# EAGLE design bitbox_rev2c-1 (EAGLE 7.6.0)
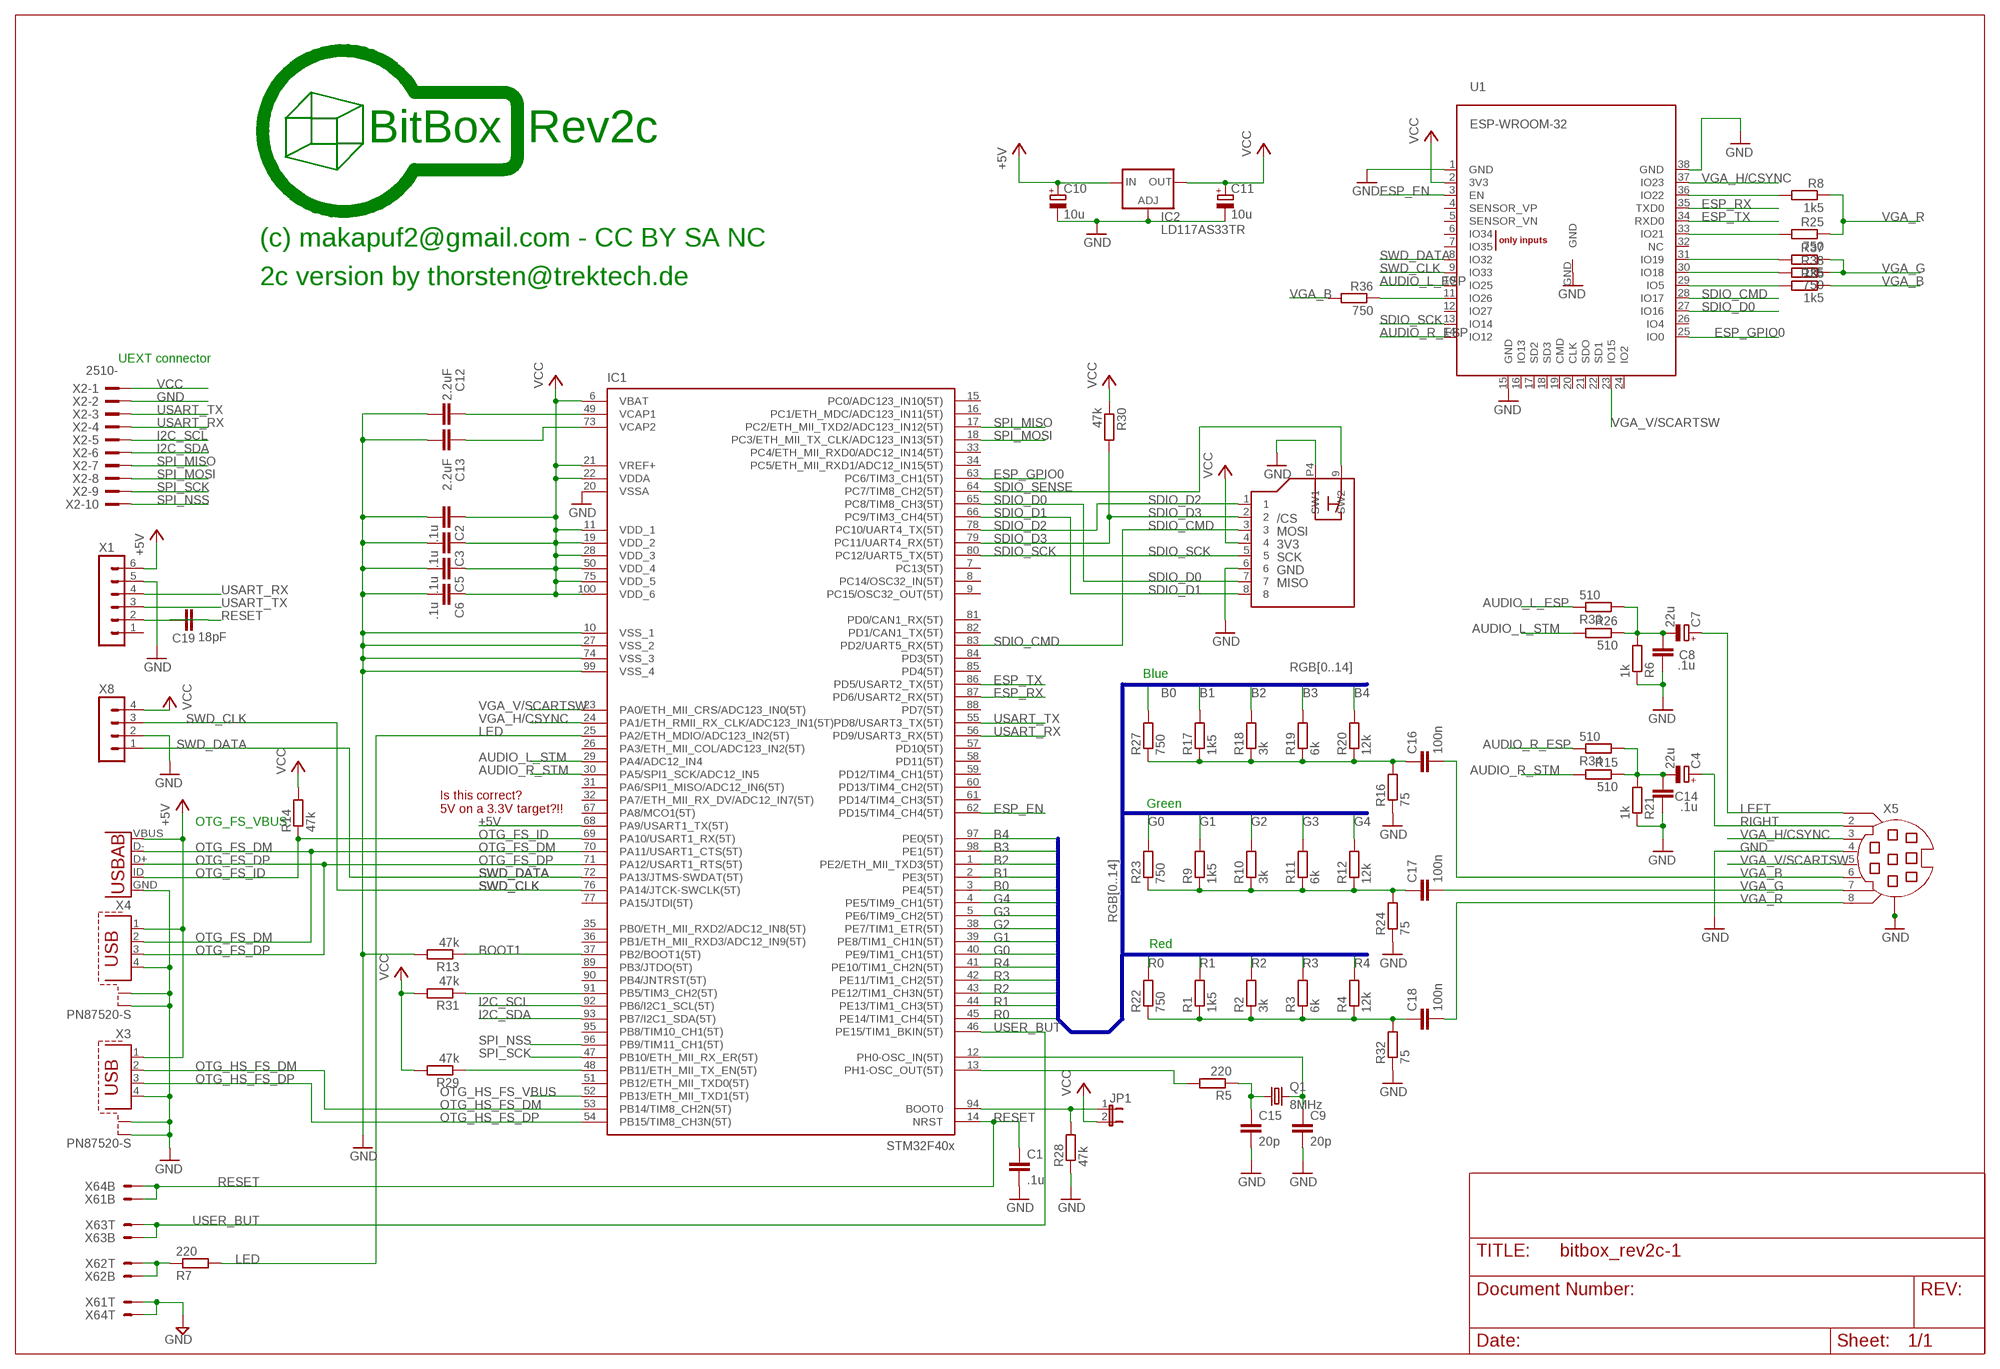
[diagram p0: schematic, sheet 1]

## Parts
C1  .1u  C-EUC0805  [C0805]
C2  .1u  C-EUC0805  [C0805]
C3  .1u  C-EUC0805  [C0805]
C4  22u  CPOL-EU153CLV-0505  [153CLV-0505]
C5  .1u  C-EUC0805  [C0805]
C6  .1u  C-EUC0805  [C0805]
C7  22u  CPOL-EU153CLV-0505  [153CLV-0505]
C8  .1u  C-EUC0805  [C0805]
C9  20p  C-EUC0805  [C0805]
C10  10u  CPOL-EUSMCA  [SMC_A]
C11  10u  CPOL-EUSMCA  [SMC_A]
C12  2.2uF  C-EUC0805  [C0805]
C13  2.2uF  C-EUC0805  [C0805]
C14  .1u  C-EUC0805  [C0805]
C15  20p  C-EUC0805  [C0805]
C16  100n  C-EUC0805  [C0805]
C17  100n  C-EUC0805  [C0805]
C18  100n  C-EUC0805  [C0805]
C19  18pF  C-EUC0805  [C0805]
IC1  STM32F407V  [TQFP100]
IC2  LD117AS33TR  [SOT223]
J1  MICROSD-SWITCH  [MICROSD-ATOM]
JP1  JP1E  [JP1]
Q1  8MHz  CRYSTALSM49  [SM49]
R1  1k5  R-EU_R0805  [R0805]
R2  3k  R-EU_R0805  [R0805]
R3  6k  R-EU_R0805  [R0805]
R4  12k  R-EU_R0805  [R0805]
R5  220  R-EU_R0805  [R0805]
R6  1k  R-EU_R0805  [R0805]
R7  220  R-EU_R0805  [R0805]
R8  1k5  R-EU_R0805  [R0805]
R9  1k5  R-EU_R0805  [R0805]
R10  3k  R-EU_R0805  [R0805]
R11  6k  R-EU_R0805  [R0805]
R12  12k  R-EU_R0805  [R0805]
R13  47k  R-EU_R0805  [R0805]
R14  47k  R-EU_R0805  [R0805]
R15  510  R-EU_R0805  [R0805]
R16  75  R-EU_R0805  [R0805]
R17  1k5  R-EU_R0805  [R0805]
R18  3k  R-EU_R0805  [R0805]
R19  6k  R-EU_R0805  [R0805]
R20  12k  R-EU_R0805  [R0805]
R21  1k  R-EU_R0805  [R0805]
R22  750  R-EU_R0805  [R0805]
R23  750  R-EU_R0805  [R0805]
R24  75  R-EU_R0805  [R0805]
R25  750  R-EU_R0805  [R0805]
R26  510  R-EU_R0805  [R0805]
R27  750  R-EU_R0805  [R0805]
R28  47k  R-EU_R0805  [R0805]
R29  47k  R-EU_R0805  [R0805]
R30  47k  R-EU_R0805  [R0805]
R31  47k  R-EU_R0805  [R0805]
R32  75  R-EU_R0805  [R0805]
R33  510  R-EU_R0805  [R0805]
R34  510  R-EU_R0805  [R0805]
R35  1k5  R-EU_R0805  [R0805]
R36  750  R-EU_R0805  [R0805]
R37  1k5  R-EU_R0805  [R0805]
R38  750  R-EU_R0805  [R0805]
U1  ESP-WROOM-32  [ESP-WROOM-32]
X1  MA06-1  [MA06-1]
X2  2510-  [PAK100/2500-10]
X3  PN87520-S  [PN87520-S]
X4  PN87520-S  [PN87520-S]
X5  MINI-DIN-8  [MINI-DIN-8]
X6  PCB_CONNECTOR_4X2  [PCB_CONNECTOR_2X4POL]
X7  USB-AB  [USB-AB-MICRO-SMD]
X8  MA04-1  [MA04-1]

## Nets
+5V: C10.+ IC1.68(PA9/USART1_TX(5T)) IC2.3(IN) X1.6 X3.1 X4.1 X7.VBUS
AUDIO_L: C7.- C8.1 R6.2 R26.1 R33.2
AUDIO_L_ESP: R33.1 U1.10(IO25)
AUDIO_L_STM: IC1.29(PA4/ADC12_IN4) R26.2
AUDIO_R: C4.- C14.1 R15.1 R21.2 R34.2
AUDIO_R_ESP: R34.1 U1.14(IO12)
AUDIO_R_STM: IC1.30(PA5/SPI1_SCK/ADC12_IN5) R15.2
B0: IC1.3(PE4(5T)) R27.2
B1: IC1.2(PE3(5T)) R17.2
B2: IC1.1(PE2/ETH_MII_TXD3(5T)) R18.2
B3: IC1.98(PE1(5T)) R19.2
B4: IC1.97(PE0(5T)) R20.2
BOOT1: IC1.37(PB2/BOOT1(5T)) R13.1
ESP_EN: IC1.62(PD15/TIM4_CH4(5T)) U1.3(EN)
ESP_GPIO0: IC1.63(PC6/TIM3_CH1(5T)) U1.25(IO0)
ESP_RX: IC1.87(PD6/USART2_RX(5T)) U1.35(TXD0)
ESP_TX: IC1.86(PD5/USART2_TX(5T)) U1.34(RXD0)
G0: IC1.40(PE9/TIM1_CH1(5T)) R23.2
G1: IC1.39(PE8/TIM1_CH1N(5T)) R9.2
G2: IC1.38(PE7/TIM1_ETR(5T)) R10.2
G3: IC1.5(PE6/TIM9_CH2(5T)) R11.2
G4: IC1.4(PE5/TIM9_CH1(5T)) R12.2
GND: C1.2 C2.2 C3.2 C5.2 C6.2 C8.2 C9.2 C10.- C11.- C12.2 C13.2 C14.2 C15.2 IC1.10(VSS_1) IC1.20(VSSA) IC1.27(VSS_2) IC1.74(VSS_3) IC1.99(VSS_4) IC2.1(ADJ) J1.6 J1.P4(SW1) R6.1 R13.2 R16.1 R21.1 R24.1 R28.1 R32.1 U1.1(GND) U1.15(GND) U1.38(GND) U1.GND X1.5 X2.2 X3.4 X3.S1 X3.S2 X4.4 X4.S1 X4.S2 X5.4 X5.G(G1) X6.1T X6.4T X7.GND X8.2
I2C_SCL: IC1.92(PB6/I2C1_SCL(5T)) X2.5
I2C_SDA: IC1.93(PB7/I2C1_SDA(5T)) X2.6
LED: IC1.25(PA2/ETH_MDIO/ADC123_IN2(5T)) R7.2
LEFT: C7.+ X5.1
N$1: C19.2 X1.2
N$2: C13.1 IC1.73(VCAP2)
N$3: C16.1 R16.2 R17.1 R18.1 R19.1 R20.1 R27.1
N$4: C12.1 IC1.49(VCAP1)
N$5: R8.2 U1.36(IO22)
N$6: C15.1 Q1.1 R5.1
N$7: C9.1 IC1.12(PH0-OSC_IN(5T)) Q1.2
N$10: C17.1 R9.1 R10.1 R11.1 R12.1 R23.1 R24.2
N$12: R25.2 U1.33(IO21)
N$15: IC1.91(PB5/TIM3_CH2(5T)) R31.1
N$16: R37.2 U1.31(IO19)
N$17: IC1.13(PH1-OSC_OUT(5T)) R5.2
N$18: IC1.94(BOOT0) JP1.1 R28.2
N$22: R38.2 U1.30(IO18)
N$23: R35.2 U1.29(IO5)
N$24: R7.1 X6.2B X6.2T
N$25: C18.1 R1.1 R2.1 R3.1 R4.1 R22.1 R32.2
N$26: R36.1 U1.11(IO26)
OTG_FS_DM: IC1.70(PA11/USART1_CTS(5T)) X4.2 X7.D-
OTG_FS_DP: IC1.71(PA12/USART1_RTS(5T)) X4.3 X7.D+
OTG_FS_ID: IC1.69(PA10/USART1_RX(5T)) R14.1 X7.ID(USBID)
OTG_HS_FS_DM: IC1.53(PB14/TIM8_CH2N(5T)) X3.2
OTG_HS_FS_DP: IC1.54(PB15/TIM8_CH3N(5T)) X3.3
OTG_HS_FS_VBUS: IC1.52(PB13/ETH_MII_TXD1(5T))
R0: IC1.45(PE14/TIM1_CH4(5T)) R22.2
R1: IC1.44(PE13/TIM1_CH3(5T)) R1.2
R2: IC1.43(PE12/TIM1_CH3N(5T)) R2.2
R3: IC1.42(PE11/TIM1_CH2(5T)) R3.2
R4: IC1.41(PE10/TIM1_CH2N(5T)) R4.2
RESET: C1.1 C19.1 IC1.14(NRST) X6.1B X6.4B
RIGHT: C4.+ X5.2
SDIO_CMD: IC1.83(PD2/UART5_RX(5T)) J1.3 U1.28(IO17)
SDIO_D0: IC1.65(PC8/TIM8_CH3(5T)) J1.7 U1.27(IO16)
SDIO_D1: IC1.66(PC9/TIM3_CH4(5T)) J1.8
SDIO_D2: IC1.78(PC10/UART4_TX(5T)) J1.1
SDIO_D3: IC1.79(PC11/UART4_RX(5T)) J1.2 R30.2
SDIO_SCK: IC1.80(PC12/UART5_TX(5T)) J1.5 U1.13(IO14)
SDIO_SENSE: IC1.64(PC7/TIM8_CH2(5T)) J1.9(SW2)
SPI_MISO: IC1.17(PC2/ETH_MII_TXD2/ADC123_IN12(5T)) X2.7
SPI_MOSI: IC1.18(PC3/ETH_MII_TX_CLK/ADC123_IN13(5T)) X2.8
SPI_NSS: IC1.96(PB9/TIM11_CH1(5T)) X2.10
SPI_SCK: IC1.47(PB10/ETH_MII_RX_ER(5T)) X2.9
SWD_CLK: IC1.76(PA14/JTCK-SWCLK(5T)) U1.9(IO33) X8.3
SWD_DATA: IC1.72(PA13/JTMS-SWDAT(5T)) U1.8(IO32) X8.1
USART_RX: IC1.56(PD9/USART3_RX(5T)) X1.4 X2.4
USART_TX: IC1.55(PD8/USART3_TX(5T)) X1.3 X2.3
USER_BUT: IC1.46(PE15/TIM1_BKIN(5T)) X6.3B X6.3T
VCC: C2.1 C3.1 C5.1 C6.1 C11.+ IC1.6(VBAT) IC1.11(VDD_1) IC1.19(VDD_2) IC1.21(VREF+) IC1.22(VDDA) IC1.28(VDD_3) IC1.50(VDD_4) IC1.75(VDD_5) IC1.100(VDD_6) IC2.2(OUT) IC2.4(OUT) J1.4 JP1.2 R14.2 R29.2 R30.1 R31.2 U1.2(3V3) X2.1 X8.4
VGA_B: C16.2 R35.1 R36.2 X5.6
VGA_G: C17.2 R37.1 R38.1 X5.7
VGA_H/CSYNC: IC1.24(PA1/ETH_RMII_RX_CLK/ADC123_IN1(5T)) U1.37(IO23) X5.3
VGA_R: C18.2 R8.1 R25.1 X5.8
VGA_V/SCARTSW: IC1.23(PA0/ETH_MII_CRS/ADC123_IN0(5T)) U1.23(IO15) X5.5
YYY: IC1.48(PB11/ETH_MII_TX_EN(5T)) R29.1
Unconnected: IC1.7(PC13(5T)) IC1.8(PC14/OSC32_IN(5T)) IC1.9(PC15/OSC32_OUT(5T)) IC1.15(PC0/ADC123_IN10(5T)) IC1.16(PC1/ETH_MDC/ADC123_IN11(5T)) IC1.26(PA3/ETH_MII_COL/ADC123_IN2(5T)) IC1.31(PA6/SPI1_MISO/ADC12_IN6(5T)) IC1.32(PA7/ETH_MII_RX_DV/ADC12_IN7(5T)) IC1.33(PC4/ETH_MII_RXD0/ADC12_IN14(5T)) IC1.34(PC5/ETH_MII_RXD1/ADC12_IN15(5T)) IC1.35(PB0/ETH_MII_RXD2/ADC12_IN8(5T)) IC1.36(PB1/ETH_MII_RXD3/ADC12_IN9(5T)) IC1.51(PB12/ETH_MII_TXD0(5T)) IC1.57(PD10(5T)) IC1.58(PD11(5T)) IC1.59(PD12/TIM4_CH1(5T)) IC1.60(PD13/TIM4_CH2(5T)) IC1.61(PD14/TIM4_CH3(5T)) IC1.67(PA8/MCO1(5T)) IC1.77(PA15/JTDI(5T)) IC1.81(PD0/CAN1_RX(5T)) IC1.82(PD1/CAN1_TX(5T)) IC1.84(PD3(5T)) IC1.85(PD4(5T)) IC1.88(PD7(5T)) IC1.89(PB3/JTDO(5T)) IC1.90(PB4/JNTRST(5T)) IC1.95(PB8/TIM10_CH1(5T)) J1.P1 J1.P2(P1) J1.P3(P1) U1.4(SENSOR_VP) U1.5(SENSOR_VN) U1.6(IO34) U1.7(IO35) U1.12(IO27) U1.16(IO13) U1.17(SD2) U1.18(SD3) U1.19(CMD) U1.20(CLK) U1.21(SDO) U1.22(SD1) U1.24(IO2) U1.26(IO4) U1.32(NC) X1.1

## Buses
RGB[0..14]

## Notes on the sheet
- BitBox  Rev2c
- (c) makapuf2@gmail.com - CC BY SA NC
- 2c version by thorsten@trektech.de
- UEXT connector
- Blue
- Green
- Is this correct?
  5V on a 3.3V target?!!
- OTG_FS_VBUS
- Red

## Library data of the parts
C1-C3 C5 C6 C8 C9 C12-C19 = Thorsten_rcl:C-EU: CAPACITOR, European symbol
C4 C7 C10 C11 = resistor:CPOL-EU: POLARIZED CAPACITOR, European symbol
IC1 = stm32f4:STM32F407V: STM32F407 100 pin LQFP reviewed: YES tested: YES
IC2 = v-reg:LD117A?*: Low drop fixed and adjustable positive voltage regulators 1 A Source: http://www.st.com/stonline/products/literature/ds/7194/ld1117axx.pdf
J1 = Thorsten_diverses:MICROSD-SWITCH
JP1 = jumper:JP1E: JUMPER
Q1 = crystal:CRYSTAL: CRYSTAL; OC_FARNELL: unknown; OC_NEWARK: unknown
R1-R38 = Thorsten_rcl:R-EU_: RESISTOR, European symbol
U1 = Sinclairwespi-nano_4:ESP-WROOM-32
X1 = con-lstb:MA06-1: PIN HEADER; OC_FARNELL: unknown; OC_NEWARK: unknown
X2 = con-3m:2510-: 3M (TM) Pak 100 4-Wall Header Source: 3M; MF: 3M; MPN: 2510-6002UB; OC_FARNELL: 9838244; OC_NEWARK: 46F4725
X3 X4 = con-berg:PN87520-S; OC_FARNELL: unknown; OC_NEWARK: unknown
X5 = Sinclairwespi-nano_4:MINI-DIN-8
X6 = Thorsten_connectors:PCB_CONNECTOR_4X2
X7 = SparkFun-Connectors:USB-AB: This is a USB AB connector that is compatible with USB OTG. i.e. this connector can serve as a host or device
X8 = con-lstb:MA04-1: PIN HEADER; OC_FARNELL: unknown; OC_NEWARK: unknown

## Board
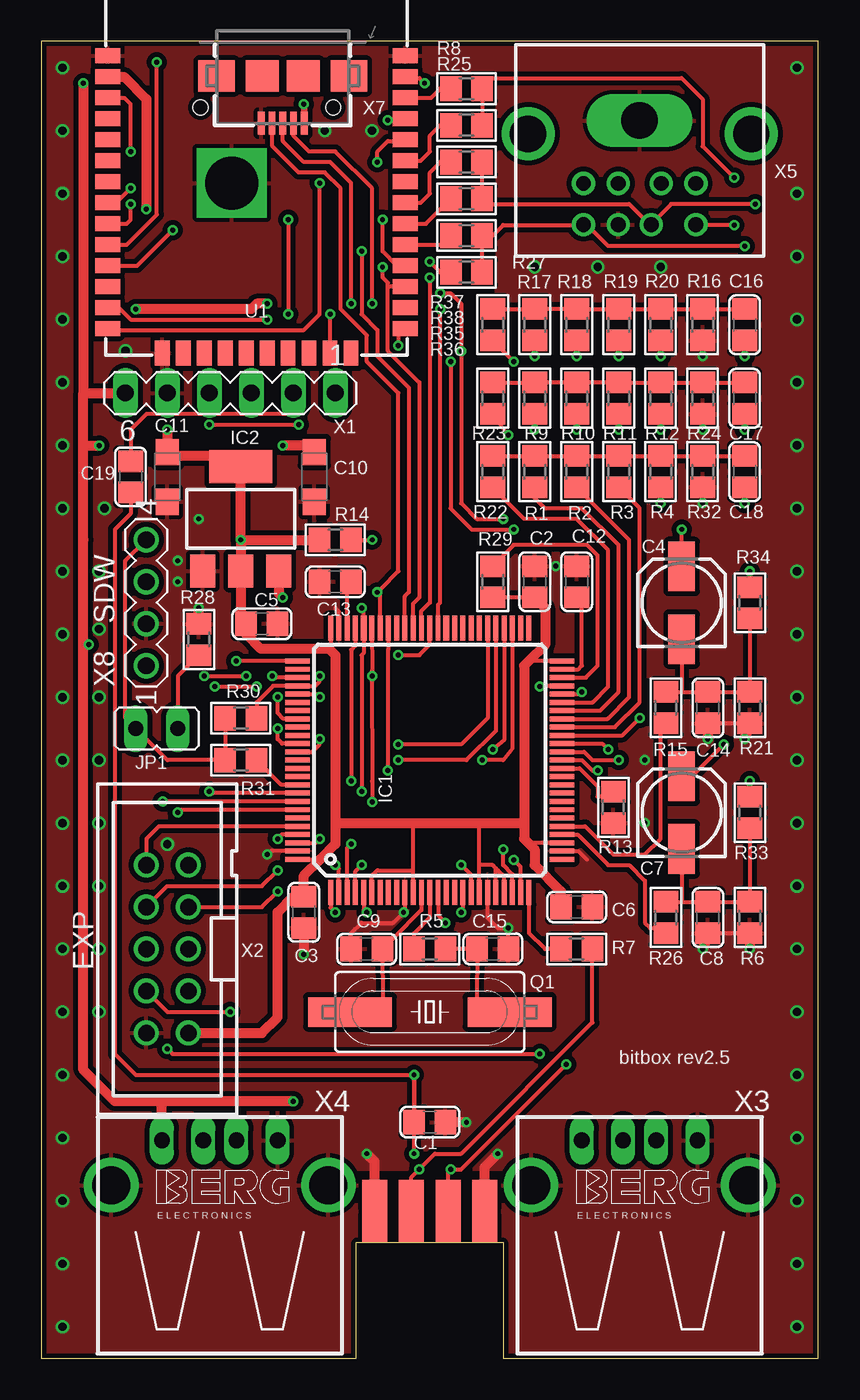
[diagram p1: board, top side]
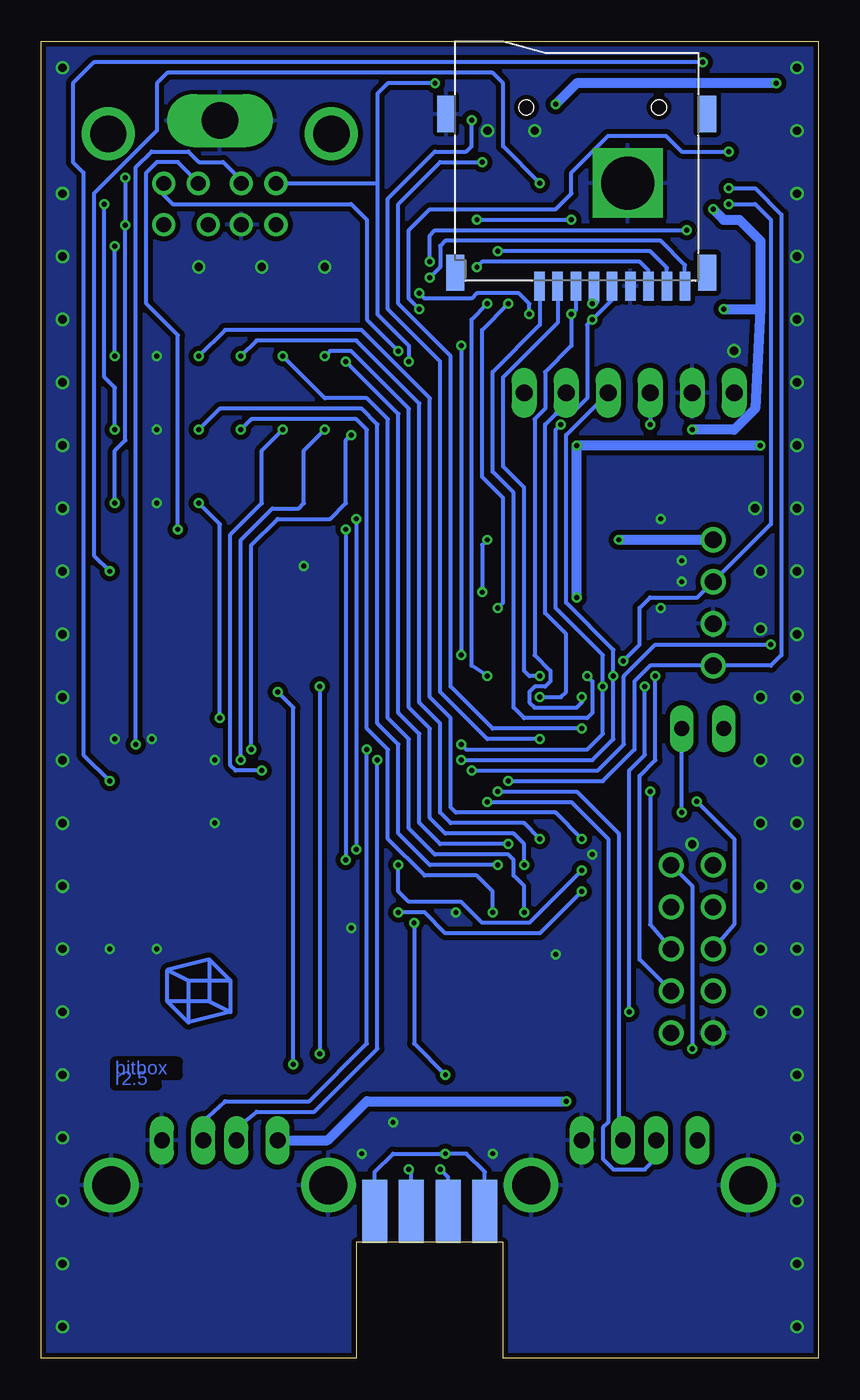
[diagram p2: board, bottom side, seen from below]

Size 47 x 79.7 mm. Coordinates in mm from the lower left corner, seen from the top.
Outline: 19.05,0 19.05,7 27.95,7 27.95,0 47,0 47,79.7 0,79.7 0,0 19.05,0
Copper layers (1*16): Top 0.035mm / dielectric 1.5mm / Bottom 0.035mm
Design rules "hackvana *": minimum track width 6mil, minimum drill 0.3mm, track to track 6mil, track to pad 6mil, pad to pad 6mil, via to via 6mil, smd to smd 0mil, copper to edge 6mil, drill to drill 6mil, minimum pad ring 10mil, minimum via ring 6mil, stop-mask expansion 2mil, vias tented up to drill 100mil, thermal gap 10mil

### Footprints (pad centres in the part's own frame; a part is rotated, then mirrored left to right if it is on the bottom)
C0805 = smd 1.3 x 1.5: 1 -0.95,0; 2 0.95,0
153CLV-0505 = smd 3 x 1.6: + 2.2,0; - -2.2,0
SMC_A = smd 1.6 x 1.4: + -1.5,0; - 1.5,0
TQFP100 = smd 1.5 x 0.3: 1 -8,6; 2 -8,5.5; 3 -8,5; 4 -8,4.5; 5 -8,4; 6 -8,3.5; 7 -8,3; 8 -8,2.5; 9 -8,2; 10 -8,1.5; 11 -8,1; 12 -8,0.5; 13 -8,0; 14 -8,-0.5; 15 -8,-1; 16 -8,-1.5; 17 -8,-2; 18 -8,-2.5; 19 -8,-3; 20 -8,-3.5; 21 -8,-4; 22 -8,-4.5; 23 -8,-5; 24 -8,-5.5; 25 -8,-6; 51 8,-6; 52 8,-5.5; 53 8,-5; 54 8,-4.5; 55 8,-4; 56 8,-3.5; 57 8,-3; 58 8,-2.5; 59 8,-2; 60 8,-1.5; 62 8,-0.5; 63 8,0; 64 8,0.5; 65 8,1; 66 8,1.5; 67 8,2; 68 8,2.5; 69 8,3; 70 8,3.5; 72 8,4.5; 73 8,5; 74 8,5.5; 75 8,6 | smd 0.3 x 1.5: 26 -6,-8; 27 -5.5,-8; 28 -5,-8; 29 -4.5,-8; 30 -4,-8; 31 -3.5,-8; 32 -3,-8; 33 -2.5,-8; 34 -2,-8; 35 -1.5,-8; 36 -1,-8; 37 -0.5,-8; 38 0,-8; 39 0.5,-8; 40 1,-8; 41 1.5,-8; 42 2,-8; 43 2.5,-8; 44 3,-8; 45 3.5,-8; 46 4,-8; 47 4.5,-8; 48 5,-8; 49 5.5,-8; 50 6,-8; 76 6,8; 77 5.5,8; 78 5,8; 79 4.5,8; 80 4,8; 81 3.5,8; 82 3,8; 83 2.5,8; 84 2,8; 85 1.5,8; 86 1,8; 87 0.5,8; 88 0,8; 89 -0.5,8; 90 -1,8; 91 -1.5,8; 92 -2,8; 93 -2.5,8; 94 -3,8; 95 -3.5,8; 96 -4,8; 97 -4.5,8; 98 -5,8; 99 -5.5,8; 100 -6,8 | smd 1.5 x 0.35: 61 8,-1; 71 8,4
SOT223 = smd 1.5 x 2: 1 -2.3,-3.15; 2 0,-3.15; 3 2.3,-3.15 | smd 3.8 x 2: 4 0,3.15
MICROSD-ATOM = smd 0.635 x 1.778: 1 2.25,0.318; 2 1.15,0.318; 3 0.05,0.318; 4 -1.05,0.318; 5 -2.15,0.318; 6 -3.25,0.318; 7 -4.35,0.318; 8 -5.45,0.318; 9 -6.55,0.318 | smd 1.067 x 2.184: P1 -7.9,-0.5; P2 7.35,-0.5; P3 -7.9,-10.1; P4 7.9,-10.1 | hole 0.88: -4.98,-10.5; 3.05,-10.5
JP1 = drill 0.914 long: 1 0,-1.27; 2 0,1.27
SM49 = smd 5.08 x 1.778: 1 -4.826,0; 2 4.826,0
R0805 = smd 1.3 x 1.5: 1 -0.95,0; 2 0.95,0
ESP-WROOM-32 = smd 0.9 x 1.5: 1 7.7,9; 2 6.43,9; 3 5.16,9; 4 3.89,9; 5 2.62,9; 6 1.35,9; 7 0.08,9; 8 -1.19,9; 9 -2.46,9; 10 -3.73,9; 11 -5,9; 12 -6.27,9; 13 -7.54,9; 14 -8.81,9; 25 -8.81,-9; 26 -7.54,-9; 27 -6.27,-9; 28 -5,-9; 29 -3.73,-9; 30 -2.46,-9; 31 -1.19,-9; 32 0.08,-9; 33 1.35,-9; 34 2.62,-9; 35 3.89,-9; 36 5.16,-9; 37 6.43,-9; 38 7.7,-9 | smd 1.5 x 0.9: 15 -10.3,5.715; 16 -10.3,4.445; 17 -10.3,3.175; 18 -10.3,1.905; 19 -10.3,0.635; 20 -10.3,-0.635; 21 -10.3,-1.905; 22 -10.3,-3.175; 23 -10.3,-4.445; 24 -10.3,-5.715 | drill 3.2 pad 3.81 square: GND 0,1.5
MA06-1 = drill 1.016 long: 1 -6.35,0; 2 -3.81,0; 3 -1.27,0; 4 1.27,0; 5 3.81,0; 6 6.35,0
PAK100/2500-10 = drill 1 pad 1.422: 1 -5.08,-1.27; 2 -5.08,1.27; 3 -2.54,-1.27; 4 -2.54,1.27; 5 0,-1.27; 6 0,1.27; 7 2.54,-1.27; 8 2.54,1.27; 9 5.08,-1.27; 10 5.08,1.27
PN87520-S = drill 0.95 long: 1 -3.5,2.71; 2 -1,2.71; 3 1,2.71; 4 3.5,2.71 | drill 2.3 pad 2.9: S1 -6.57,0; S2 6.57,0
MINI-DIN-8 = drill 0.9: 1 1.3,8.4; 2 -1.3,8.4; 3 3.4,8.4; 4 1.3,10.9; 5 -3.4,8.4; 6 3.4,10.9; 7 -0.7,10.9; 8 -3.4,10.9 | drill 2.2 long: G 0,4.6 | drill 2.2: G1 -6.75,5.4; G2 6.75,5.4
PCB_CONNECTOR_2X4POL = smd 1.524 x 3.81 bottom: 1B -3.334,1.905; 2B -1.111,1.905; 3B 1.111,1.905; 4B 3.334,1.905 | smd 1.524 x 3.81: 1T -3.334,1.905; 2T -1.111,1.905; 3T 1.111,1.905; 4T 3.334,1.905
USB-AB-MICRO-SMD = smd 1.4 x 0.4: D+ 2.85,0; D- 2.85,0.65; GND 2.85,-1.3; ID 2.85,-0.65; VBUS 2.85,1.3 | smd 1.9 x 2: P$6 0,1.25; P$7 0,-1.25 | smd 1.9 x 2.2: P$8 0,4; P$9 0,-4
MA04-1 = drill 1.016: 1 -3.81,0; 2 -1.27,0; 3 1.27,0; 4 3.81,0

### Placement (x,y rotation side)
C1  23.5,14.29 0 top
C2  29.85,46.99 90 top
C3  15.88,26.99 270 top
C4  38.74,45.72 90 top
C5  13.34,44.45 0 top
C6  32.39,27.3 0 top
C7  38.74,33.02 90 top
C8  40.33,26.67 270 top
C9  19.69,24.77 180 top
C10  16.52,53.34 270 top
C11  7.62,53.34 270 top
C12  32.39,46.99 90 top
C13  17.79,46.99 180 top
C14  40.33,39.37 270 top
C15  27.31,24.77 0 top
C16  42.55,62.55 270 top
C17  42.55,58.1 270 top
C18  42.55,53.66 270 top
C19  5.4,53.34 90 top
IC1  23.5,36.2 90 top
IC2  12.07,50.8 0 top
J1  14.61,65.2 180 bottom
JP1  6.99,38.1 90 top
Q1  23.5,20.95 180 top
R1  29.85,53.66 270 top
R2  32.39,53.66 270 top
R3  34.93,53.66 270 top
R4  37.47,53.66 270 top
R5  23.5,24.77 180 top
R6  42.87,26.67 90 top
R7  32.39,24.77 180 top
R8  25.72,76.83 180 top
R9  29.85,58.1 270 top
R10  32.39,58.1 270 top
R11  34.93,58.1 270 top
R12  37.47,58.1 270 top
R13  34.61,33.34 270 top
R14  17.79,49.53 180 top
R15  37.79,39.37 270 top
R16  40.01,62.55 90 top
R17  29.85,62.55 270 top
R18  32.39,62.55 270 top
R19  34.93,62.55 270 top
R20  37.47,62.55 270 top
R21  42.87,39.37 90 top
R22  27.31,53.66 270 top
R23  27.31,58.1 270 top
R24  40.01,58.1 90 top
R25  25.72,74.61 180 top
R26  37.79,26.67 270 top
R27  27.31,62.55 270 top
R28  9.53,43.5 270 top
R29  27.31,46.99 270 top
R30  12.07,38.73 0 top
R31  12.07,36.2 180 top
R32  40.01,53.66 90 top
R33  42.87,33.02 270 top
R34  42.87,45.72 270 top
R35  25.72,67.94 180 top
R36  25.72,65.72 0 top
R37  25.72,72.39 180 top
R38  25.72,70.17 180 top
U1  13.02,71.12 90 top
X1  11.44,58.42 180 top
X2  7.62,24.77 90 top
X3  36.2,10.47 0 top
X4  10.8,10.47 0 top
X5  36.2,79.5 180 top
X6  23.5,6.99 0 top
X7  14.6,77.6 270 top
X8  6.36,45.72 90 top

### Tracks (layer width: path | path; a pad name or v marks a point on that pad's centre or on a via)
+5V  (via drill 0.3, 0.3 pad 0.2)
  Top 0.254: IC1.68 21,42.9 20.96,42.86 v20.96,35.56 | v2.86,43.18 2.54,43.18 | 2.54,43.18
  Top 0.406: v15.88,75.88 15.91,75.91 X7.VBUS
  Top 0.61: 2.55,55.24 2.54,49.52 2.54,43.18 2.55,17.46 4.45,15.56 7.31,15.56 | 2.55,55.24 v3.5,55.24 | C10.+ 16.52,55.24 v14.61,55.24 | 2.55,55.24 2.55,58.42 | 2.55,58.42 X1.6 | v15.24,15.56 7.31,15.56 | X4.1 7.3,15.55 7.31,15.56 | IC2.3 14.37,46.28 v14.61,46.04 | v2.55,77.15 2.55,58.42
  Bottom 0.254: v20.96,35.56 13.34,35.56 11.75,37.15 11.75,41.27 9.85,43.18 v2.86,43.18
  Bottom 0.61: v3.5,55.24 v14.61,55.24 v14.61,46.04 | X3.1 29.68,13.19 27.31,15.56 v15.24,15.56 | v2.55,77.15 14.61,77.15 v15.88,75.88
AUDIO_L
  Top 0.254: R26.1 38.74,27.62 | 38.74,27.62 C8.1 R6.2 R33.2 | C7.- 38.74,27.62
AUDIO_L_ESP  (via drill 0.3 pad 0.2)
  Top 0.254: v6.99,78.42 6.99,69.22 5.16,67.39 U1.10 | v42.87,34.92 R33.1
  Bottom 0.254: v6.99,78.42 43.82,78.42 45.09,77.15 45.09,72.39 44.45,71.75 44.45,36.51 v42.87,34.92
AUDIO_L_STM
  Top 0.254: IC1.29 32.45,31.7 34.3,29.84 35.56,29.84 36.52,28.89 36.52,26.35 36.84,26.04 37.47,26.04 R26.2
AUDIO_R
  Top 0.254: R15.1 38.74,40.32 | 38.74,40.32 C14.1 R21.2 R34.2 | C4.- 38.74,40.32
AUDIO_R_ESP  (via drill 0.3 pad 0.2)
  Top 0.254: v16.83,71.12 16.83,63.18 15.88,62.23 4.45,62.23 4.37,62.31 U1.14 | v42.87,47.62 R34.1
  Bottom 0.254: v16.83,71.12 19.05,73.34 19.05,77.15 19.69,77.79 39.38,77.79 40.01,77.15 40.01,74.3 43.82,70.48 43.82,48.58 v42.87,47.62
AUDIO_R_STM
  Top 0.254: IC1.30 32.9,32.2 34.61,30.48 36.52,30.48 37.47,31.43 37.47,38.1 R15.2
B0  (via drill 0.3)
  Top 0.254: v28.58,60.33 R27.2 | IC1.3 18.5,30.88 v18.74,31.11
  Bottom 0.254: v18.74,31.11 22.86,31.11 24.14,32.38 24.14,37.78 25.41,39.05 25.41,57.15 v28.58,60.33
B1  (via drill 0.3)
  Top 0.254: v29.85,60.64 R17.2 | IC1.2 18,29.63 v17.79,29.84
  Bottom 0.254: v17.79,29.84 17.79,31.11 18.42,31.75 22.55,31.75 23.5,32.7 23.5,38.1 24.77,39.37 24.77,57.47 28.26,60.96 29.53,60.96 v29.85,60.64
B2  (via drill 0.3)
  Top 0.254: v32.39,60.64 R18.2 | IC1.1 17.5,27.27 v17.79,26.99
  Bottom 0.254: v17.79,26.99 17.79,28.57 18.42,29.21 18.42,30.16 18.74,30.48 23.18,30.48 24.77,32.07 24.77,37.47 26.04,38.73 26.04,56.83 27.31,58.1 29.85,58.1 v32.39,60.64
B3  (via drill 0.3)
  Top 0.254: v34.93,60.64 R19.2 | IC1.98 16.59,31.2 v16.83,31.43
  Bottom 0.254: v16.83,31.43 17.79,32.38 22.23,32.38 22.86,33.02 22.86,38.42 24.14,39.69 24.14,57.78 27.95,61.59 33.98,61.59 v34.93,60.64
B4  (via drill 0.3)
  Top 0.254: v37.47,60.64 R20.2 | IC1.97 14.55,31.7 v14.29,31.43
  Bottom 0.254: v14.29,31.43 15.88,33.02 21.91,33.02 22.23,33.34 22.23,38.73 23.5,40.01 23.5,58.1 27.63,62.23 35.88,62.23 v37.47,60.64
BOOT1
  Top 0.254: IC1.37 32.57,35.7 33.66,34.61 33.66,33.98 R13.1
ESP_EN  (via drill 0.3)
  Top 0.254: IC1.62 24,45.59 24.14,45.72 v24.14,63.5 | v5.4,73.03 5.4,75.88 5,76.28 U1.3
  Bottom 0.254: v24.14,63.5 24.77,64.14 24.77,68.26 23.5,69.53 15.88,69.53 14.93,70.48 14.93,71.75 12.71,73.98 9.21,73.98 8.26,73.03 v5.4,73.03
ESP_GPIO0  (via drill 0.3)
  Top 0.254: U1.25 21.99,62.31 21.59,61.91 v21.59,61.28 | v21.59,42.55 22.86,42.55 23.5,43.18 IC1.63
  Bottom 0.254: v21.59,61.28 v21.59,42.55
ESP_RX  (via drill 0.3 pad 0.2)
  Top 0.254: IC1.87 16.38,36.7 16.83,37.15 v16.83,37.47 | v20.96,74.93 21.94,74.93 U1.35
  Bottom 0.254: v16.83,37.47 20.01,37.47 22.86,40.32 22.86,60.33 26.04,63.5 26.04,70.17 23.18,73.03 21.28,73.03 20.96,73.34 v20.96,74.93
ESP_TX  (via drill 0.3 pad 0.2)
  Top 0.254: IC1.86 14.56,37.2 14.29,37.47 v14.29,38.1 | v20.32,72.39 20.32,73.03 20.96,73.66 21.94,73.66 U1.34
  Bottom 0.254: v14.29,38.1 19.69,38.1 22.23,40.64 22.23,60.64 25.41,63.82 25.41,69.85 22.86,72.39 v20.32,72.39
G0  (via drill 0.3)
  Top 0.254: v28.26,55.88 R23.2 | IC1.40 33.93,37.2 v34.3,36.83
  Bottom 0.254: v34.3,36.83 34.3,49.21 32.71,50.8 29.53,50.8 28.58,51.75 28.58,55.56 v28.26,55.88
G1  (via drill 0.3)
  Top 0.254: v29.85,56.2 R9.2 | IC1.39 32.84,36.7 33.34,36.2 v34.93,36.2
  Bottom 0.254: v34.93,36.2 34.93,49.53 33.02,51.44 31.44,51.44 31.12,51.75 31.12,54.93 v29.85,56.2
G2  (via drill 0.3)
  Top 0.254: v32.39,56.2 R10.2 | IC1.38 32.71,36.2 33.34,35.56 v33.66,35.56
  Bottom 0.254: v33.66,35.56 35.25,35.56 35.56,35.88 35.56,49.85 33.66,51.75 33.66,54.93 v32.39,56.2
G3  (via drill 0.3)
  Top 0.254: R11.2 v34.93,56.2 | IC1.5 19.5,27.11 v19.69,26.99
  Bottom 0.254: v19.69,26.99 19.69,28.26 20.64,29.21 23.82,29.21 26.04,31.43 26.04,36.83 27.31,38.1 27.31,56.2 27.95,56.83 34.3,56.83 v34.93,56.2
G4  (via drill 0.3)
  Top 0.254: v37.47,56.2 R12.2 | IC1.4 19,29.47 v19.37,29.84
  Bottom 0.254: v19.37,29.84 23.5,29.84 25.41,31.75 25.41,37.15 26.68,38.42 26.68,56.52 27.63,57.47 36.2,57.47 v37.47,56.2
GND  (via drill 0.3, 0.5)
  Top 0.254: IC1.99 13.87,30.7 v13.66,30.48 | IC1.10 22,27.22 v21.91,26.99 21.28,26.35 19.37,26.35 18.73,25.71 C9.2 | IC1.20 27,27.61 26.99,27.61 26.99,26.67 27.63,26.04 v28.26,26.04 28.26,25.72 C15.2 | IC1.27 32.49,30.7 33.02,30.16 | R21.1 C14.2 | R16.1 v40.01,60.64 | R24.1 v40.01,56.2 | R32.1 v40.01,51.75 | R6.1 C8.2 | IC1.74 18,45.19 17.79,45.4
  Top 0.61: v42.55,37.47 R21.1 | R6.1 v42.87,24.77 | C8.2 v40.01,24.77 | C14.2 v40.33,37.47 | X6.1T 20.17,11.91 v19.69,12.38 | X6.4T 26.83,11.59 v27.63,12.38 | v25.72,14.29 C1.2 | C3.2 v15.88,24.45 | R28.1 v9.53,45.4
  other vias: 31.12,47.94 8.26,46.99 9.53,50.8 8.26,48.26 36.52,36.2 45.73,40.01 1.27,66.67 1.27,78.11 1.27,74.3 1.27,70.48 29.85,66.04 33.66,66.04 37.47,66.04 45.73,51.44 45.73,47.62 45.73,43.81 45.73,36.2 45.73,32.38 45.73,28.57 7.62,31.11 45.73,66.67 45.73,78.11 45.73,70.48 45.73,62.87 45.73,59.05 45.73,55.24 45.73,13.34 45.73,24.77 45.73,20.95 45.73,17.14 45.73,9.53 45.73,5.71 45.73,1.91 1.27,40.01 1.27,51.44 1.27,47.62 1.27,43.81 1.27,36.2 1.27,32.38 1.27,28.57 1.27,62.87 1.27,59.05 1.27,55.24 1.27,13.34 1.27,24.77 1.27,20.95 1.27,17.14 1.27,9.53 1.27,5.71 1.27,1.91 36.52,32.38 5.09,60.96 17.15,74.3 20.01,74.3 3.82,51.44 3.5,47.62 3.5,44.13 3.5,40.01 3.5,36.2 3.5,32.38 3.5,28.57 3.5,24.77 3.5,20.95
  pour Bottom (isolate 0.3): 0,79.7 47,79.7 47,0 27.95,0 27.95,11.43 19.05,11.43 19.05,0 0,0
  pour Top (isolate 0.3): 0,79.7 47,79.7 47,0 27.95,0 27.95,11.43 19.05,11.43 19.05,0 0,0
I2C_SCL  (via drill 0.3)
  Top 0.254: IC1.92 10.39,34.2 v10.16,34.29
  Bottom 0.254: v10.16,34.29 10.16,26.25 X2.5
I2C_SDA  (via drill 0.3)
  Top 0.254: IC1.93 v7.35,33.7
  Bottom 0.254: v7.35,33.7 5.09,31.43 5.09,26.25 X2.6
LED
  Top 0.254: R7.2 30.48,24.77 29.5,25.75 IC1.25
LEFT  (via drill 0.3)
  Top 0.254: C7.+ 39.38,35.24 v41.28,37.15
  Bottom 0.254: v41.28,37.15 41.28,72.07 40.33,73.03 38.11,73.03 37.47,72.39 36,72.39 34.9,71.29 X5.1
N$1
  Top 0.254: X1.2 15.24,57.47 14.93,57.15 6.36,57.15 5.4,56.2 C19.2
N$2
  Top 0.254: IC1.73 18.5,46.59 C13.1
N$3
  Top 0.254: C16.1 R16.2 R20.1 R19.1 R18.1 R17.1 | R27.1 R17.1 | R17.1
N$4
  Top 0.254: IC1.49 32.49,41.7 32.71,41.91 32.71,45.72 C12.1
N$5
  Top 0.254: R8.2 24.14,76.83 23.58,76.28 U1.36
N$6
  Top 0.254: Q1.1 28.26,20.89 27.06,20.89 26.36,21.59 C15.1 R5.1
N$7
  Top 0.254: 18.74,20.89 Q1.2 18.74,21.02 20.07,21.02 20.64,21.59 C9.1 21.28,25.4 23,27.12 IC1.12
N$10
  Top 0.254: C17.1 R24.2 R12.1 R11.1 R10.1 32.71,59.37 32.71,59.05 30.17,59.05 | R23.1 27.63,59.37 27.63,59.05 30.17,59.05 | 30.17,59.05 30.16,59.05 R9.1
N$12
  Top 0.254: R25.2 24.14,74.61 23.5,73.97 23.5,73.03 22.95,72.47 U1.33
N$13
  Bottom 0.254: 35.56,22.86 35.56,20.95 | 35.56,20.95 38.11,20.32 | 38.11,22.86 35.56,22.86 | 35.56,22.86 36.84,24.13 | 36.84,24.13 39.38,23.5 | 39.38,23.5 38.11,22.86 | 38.11,22.86 38.11,20.32 | 38.11,20.32 39.38,21.59 | 39.38,21.59 39.38,23.5 | 36.84,24.13 36.84,21.59 | 36.84,21.59 35.56,20.95 | 36.84,21.59 39.38,21.59
N$15
  Top 0.254: IC1.91 14.52,34.7 R31.1
N$16
  Top 0.254: R37.2 24.14,72.39 23.5,71.75 23.5,70.48 22.95,69.93 U1.31
N$17
  Top 0.254: IC1.13 23.5,26.67 22.55,25.72 R5.2
N$18  (via drill 0.3)
  Top 0.254: IC1.94 8.4,33.2 v8.26,33.02 | R28.2 8.26,41.27 JP1.1
  Bottom 0.254: v8.26,33.02 JP1.1
N$22
  Top 0.254: R38.2 23.27,68.66 U1.30
N$23
  Top 0.254: 24.54,67.71 R35.2 24.22,67.39 U1.29
N$24  (via drill 0.3)
  Top 0.254: X6.2B 22.39,10.95 v22.86,11.43 23.82,12.38 25.41,12.38 33.34,20.32 33.34,25.4 R7.1
  Bottom 0.254: X6.2B 22.39,10.95 v22.86,11.43
N$25
  Top 0.254: R22.1 R1.1 R2.1 R3.1 R4.1 R32.2 C18.1
N$26  (via drill 0.3, 0.3 pad 0.2)
  Top 0.254: v7.94,68.26 5.8,66.12 U1.11 | R36.1 24.14,65.72 v23.5,66.36
  Bottom 0.254: v23.5,66.36 23.5,67.94 23.18,68.26 v7.94,68.26
OTG_FS_DM  (via drill 0.3, 0.3 pad 0.2)
  Top 0.254: X7.D- 15.24,74.43 15.24,73.98 16.2,73.03 17.79,73.03 20.01,70.8 v20.01,63.82 | IC1.70 20.01,41.59 v20,41.27 20.01,34.92 v20.01,33.66
  Top 0.305: v20.01,41.27 v20,41.27
  Bottom 0.254: v20.01,33.66 14.93,33.66 12.71,31.43 12.71,14.29 13.02,13.97 13.02,12.06 12.39,11.43 10.48,11.43 9.8,12.11 X4.2 | v20.01,41.27 20.96,41.91 20.96,62.87 v20.01,63.82
OTG_FS_DP  (via drill 0.3)
  Top 0.254: X7.D+ 14.61,74.44 14.61,73.66 15.88,72.39 17.47,72.39 18.74,71.12 v18.74,63.82 | v19.37,34.29 19.37,42.55 19.5,42.67 IC1.71 19.5,45.21 v19.37,45.4
  Bottom 0.254: v19.37,34.29 14.61,34.29 12.07,31.75 12.07,13.46 X4.3 | v19.37,45.4 19.05,45.72 19.05,52.07 20.32,53.34 20.32,62.23 v18.74,63.82
OTG_FS_ID  (via drill 0.3)
  Top 0.254: IC1.69 20.5,46.53 | X7.ID 13.97,74.42 13.97,73.34 15.56,71.75 17.15,71.75 18.1,70.8 18.1,63.5 19.69,61.91 19.69,60.33 21.59,58.42 21.59,47.62 20.5,46.53 | R14.1 v20.01,49.53 | 20.5,46.53 20.47,46.53 v20.32,46.35
  Bottom 0.254: v20.01,49.53 20.32,49.21 v20.32,46.35
OTG_HS_FS_DM  (via drill 0.3)
  Top 0.254: IC1.53 28.5,36.91 27.95,36.2 v26.68,36.2
  Bottom 0.254: X3.2 35.2,13.92 33.98,14.92 30.48,14.92 26.68,18.73 v26.68,36.2
OTG_HS_FS_DP  (via drill 0.3)
  Top 0.254: IC1.54 28,37.41 v27.31,36.83
  Bottom 0.254: X3.3 37.2,14.34 35.88,15.56 30.8,15.56 27.31,19.05 v27.31,36.83
R0
  Top 0.254: R22.2 27.95,52.07 29.21,50.8 32.39,50.8 34.3,48.9 34.3,40.64 33.35,39.7 IC1.45
R1
  Top 0.254: R1.2 29.85,52.07 30.48,51.44 32.71,51.44 34.93,49.21 34.93,40.32 33.8,39.2 IC1.44
R2
  Top 0.254: R2.2 35.56,49.53 35.56,40.01 34.26,38.7 IC1.43
R3
  Top 0.254: IC1.42 34.71,38.2 36.2,39.69 36.2,51.44 R3.2
R4  (via drill 0.3)
  Top 0.254: v37.47,51.75 R4.2 | IC1.41 35.16,37.7 v36.2,38.73
  Bottom 0.254: v36.2,38.73 36.2,50.48 v37.47,51.75
RESET  (via drill 0.3)
  Top 0.254: v22.55,12.38 v22.55,17.14 C1.1 v22.55,17.15 v22.55,17.14 5.72,17.14 4.45,18.41 4.45,50.16 5.4,51.12 C19.1 | IC1.14 24,26.8 v24.45,26.35
  Bottom 0.254: X6.4B 26.83,11.27 25.72,12.38 v22.55,12.38 21.28,12.38 20.17,11.27 X6.1B | v24.45,26.35 24.45,19.05 v22.55,17.14
RIGHT  (via drill 0.3)
  Top 0.254: C4.+ v38.74,50.16
  Bottom 0.254: v38.74,50.16 38.74,61.91 40.64,63.82 40.64,71.75 40.01,72.39 38.74,72.39 37.5,71.15 X5.2
SDIO_CMD  (via drill 0.3, 0.3 pad 0.2)
  Top 0.254: v14.29,40.01 14.29,39.05 14.65,38.7 IC1.83 | 22.15,66.12 U1.28 21.52,66.12 20.64,66.99 v20.64,68.9 | v14.93,68.9 v14.93,63.18
  Bottom 0.254: J1.3 14.66,63.45 v14.93,63.18 14.93,61.28 16.52,59.69 16.52,57.47 17.15,56.83 17.15,42.55 16.2,41.59 16.2,40.96 16.52,40.64 17.15,40.64 17.47,40.32 17.47,39.69 17.15,39.37 14.61,39.37 14.29,39.69 v14.29,40.01 | v20.64,68.9 v14.93,68.9
SDIO_D0  (via drill 0.3)
  Top 0.254: IC1.65 22.5,45.67 22.86,46.04 22.86,59.05 20.96,60.96 20.96,64.77 | v20.64,66.04 20.64,65.41 20.96,65.09 20.96,64.77 | U1.27 21.04,64.85 20.96,64.77
  Bottom 0.254: J1.7 10.26,65.82 10.8,66.36 20.32,66.36 v20.64,66.04
SDIO_D1  (via drill 0.3)
  Top 0.254: v19.37,66.99 19.37,63.18 20.32,62.23 20.32,60.64 22.23,58.74 22.23,46.35 22,46.12 IC1.66
  Bottom 0.254: J1.8 9.16,65.99 10.16,66.99 v19.37,66.99
SDIO_D2  (via drill 0.3)
  Top 0.254: IC1.78 14.21,41.2 v13.97,41.27
  Bottom 0.254: J1.1 16.83,62.55 19.69,59.69 19.69,53.66 18.42,52.39 18.42,39.37 17.79,38.73 13.97,38.73 13.66,39.05 13.66,40.96 v13.97,41.27
SDIO_D3  (via drill 0.3 pad 0.2)
  Top 0.254: R30.2 13.02,39.69 14.03,40.7 IC1.79 16.57,40.7 16.83,40.96 v16.83,41.27
  Bottom 0.254: J1.2 15.76,62.67 19.05,59.37 19.05,53.98 17.79,52.7 17.79,41.59 17.47,41.27 v16.83,41.27
SDIO_SCK  (via drill 0.3, 0.3 pad 0.2)
  Top 0.254: IC1.80 16.7,40.2 v16.83,40.01 | v13.66,62.87 5.4,62.87 4.69,63.58 U1.13
  Bottom 0.254: v16.83,40.01 15.56,40.01 15.24,40.32 15.24,43.81 16.52,45.09 16.52,56.52 15.88,57.15 14.93,57.15 13.97,58.1 13.97,62.55 v13.66,62.87 12.46,64.06 J1.5
SDIO_SENSE  (via drill 0.3)
  Top 0.254: v23.5,65.41 23.5,45.72 23,45.22 IC1.64
  Bottom 0.254: J1.9 8.06,66.16 9.53,67.63 22.55,67.63 22.86,67.31 22.86,66.04 v23.5,65.41
SPI_MISO  (via drill 0.3)
  Top 0.254: X2.7 13.34,27.3 v14.29,28.26 | IC1.17 25.5,27.08 v25.41,26.99
  Bottom 0.254: v14.29,28.26 16.83,25.72 22.55,25.72 23.82,26.99 v25.41,26.99
SPI_MOSI  (via drill 0.3)
  Top 0.254: X2.8 7.62,28.57 13.34,28.57 v14.29,29.53 | IC1.18 26,29.25 v25.41,29.84
  Bottom 0.254: v14.29,29.53 17.47,26.35 20.32,26.35 21.59,27.62 24.77,27.62 25.41,28.26 v25.41,29.84
SPI_NSS
  Top 0.254: X2.10 6.36,31.43 7.12,32.2 IC1.96
SPI_SCK  (via drill 0.3)
  Top 0.254: IC1.47 30.22,40.7 v30.17,40.64 | v7.62,18.73 7.94,18.41 v30.17,18.41
  Bottom 0.254: v30.17,40.64 v30.17,18.41 | X2.9 7.62,28.57 v7.62,18.73
SWD_CLK  (via drill 0.3)
  Top 0.254: IC1.76 v11.79,42.2 | U1.9 5.16,68.66 5.4,68.9 v5.4,69.85
  Bottom 0.254: v11.79,42.2 10.8,43.18 10.8,45.4 10.16,46.04 7.31,46.04 X8.3 2.86,50.48 2.86,68.9 3.82,69.85 v5.4,69.85
SWD_DATA  (via drill 0.3)
  Top 0.254: IC1.72 19,43.12 18.74,42.86 v18.74,34.92 | U1.8 4.53,69.93 v5.4,70.8
  Bottom 0.254: v18.74,34.92 13.02,34.92 11.12,36.83 11.12,40.96 10.16,41.91 X8.1 2.86,41.91 2.23,42.55 2.23,69.22 3.82,70.8 v5.4,70.8
USART_RX  (via drill 0.3)
  Top 0.254: IC1.56 27,38.74 25.41,37.15 v21.59,37.15 | X2.4 7.62,20.95 v11.44,20.95 | v10.48,40.64 v13.02,40.64 | v10.16,56.52 v15.56,56.52
  Bottom 0.254: v21.59,37.15 21.28,36.83 13.97,36.83 13.02,37.78 v13.02,40.64 13.02,42.55 15.88,45.4 15.88,56.2 v15.56,56.52 | v11.44,20.95 11.44,35.56 10.48,36.51 v10.48,40.64 | X1.4 v10.16,56.52
USART_TX  (via drill 0.3)
  Top 0.254: IC1.55 27.5,37.97 25.72,36.2 v21.59,36.2 | v9.85,41.27 v12.39,41.27
  Bottom 0.254: v21.59,36.2 13.66,36.2 12.39,37.47 v12.39,41.27 12.39,42.86 15.24,45.72 15.24,55.88 X1.3 | X2.3 10.8,24.13 10.8,35.24 9.85,36.2 v9.85,41.27
USER_BUT  (via drill 0.3)
  Top 0.254: X6.3B 24.61,11.27 v24.77,11.43 25.41,11.43 v31.76,17.78 | IC1.46 32.58,40.2 v32.71,40.32
  Bottom 0.254: X6.3B 24.61,11.27 v24.77,11.43 | v31.76,17.78 31.76,39.37 v32.71,40.32
VCC  (via drill 0.3, 0.3 pad 0.2)
  Top 0.254: IC1.100 16.87,30.2 | IC1.75 17.5,42.83 | IC1.50 29.5,42.2 | IC1.28 29.3,31.2 29.21,31.43 | IC1.22 28,29.16 27.63,29.53 27.5,29.53 | IC1.11 22.5,29.53 | 22.5,29.53 22.5,32.34 22.55,32.38 | IC1.6 20,29.2 20.32,29.53 22.5,29.53 | IC1.19 26.5,29.84 | 26.5,29.84 26.5,32.24 26.36,32.38 | IC1.21 27.5,29.53 | 27.5,29.53 27.5,29.66 27.31,29.84 26.5,29.84 | X8.4 5.09,48.26 5.09,38.73 JP1.2 7.62,36.2 R31.2 R30.1 | C2.1 R29.2
  Top 0.61: 17.79,32.38 17.79,42.55 17.5,42.83 17.41,42.92 13.28,42.92 12.39,43.81 12.39,44.77 C5.1 12.07,44.45 IC2.2 v12.07,49.53 | 17.79,32.38 17.79,31.11 16.87,30.2 15.88,29.21 C3.1 15.24,27.94 14.29,26.99 14.29,20.64 13.34,19.68 X2.1 | C6.1 31.44,28.25 29.85,29.84 29.85,30.8 29.21,31.43 29.21,32.38 | 29.21,32.38 29.21,41.91 29.5,42.2 30.48,43.18 30.48,45.4 C2.1 | 17.79,32.38 22.55,32.38 26.36,32.38 29.21,32.38 | v13.66,63.82 13.02,63.82 12.71,63.5 v5.72,63.5 | v12.07,49.53 IC2.4 12.07,54.61 7.62,54.61 C11.+ v7.62,56.2 | v12.07,49.53 R14.2 | v6.36,69.53 6.36,76.2 5,77.55 U1.2
  Bottom 0.61: J1.4 13.56,63.91 v13.66,63.82 | X8.4 v12.07,49.53 | v5.72,63.5 3.5,63.5 | 3.5,63.5 3.82,57.47 5.09,56.2 v7.62,56.2 | v6.36,69.53 5.72,68.9 4.77,68.9 3.5,67.63 3.5,63.5
VGA_B  (via drill 0.3)
  Top 0.254: C16.2 v42.55,60.64 | v42.55,67.31 34.3,67.31 33.01,68.6 X5.6 32.78,68.58 27.95,68.58 27.31,67.94 R35.1 R36.2
  Bottom 0.254: v42.55,60.64 v42.55,67.31
VGA_G  (via drill 0.3)
  Top 0.254: C17.2 v42.55,56.2 | v43.19,69.85 38.11,69.85 36.9,68.64 X5.7 36.81,68.6 35.56,69.85 26.99,69.85 R38.1 R37.1
  Bottom 0.254: v42.55,56.2 42.55,58.74 43.19,59.37 v43.19,69.85
VGA_H/CSYNC  (via drill 0.3, 0.3 pad 0.2)
  Top 0.254: v24.77,60.33 24.77,51.44 26.04,50.16 v28.58,50.16 | IC1.24 29,29.74 v28.58,30.16 | U1.37 22.1,77.47 22.86,77.47 v23.18,77.15
  Bottom 0.254: v28.58,50.16 v28.58,30.16 | v23.18,77.15 26.04,77.15 26.68,76.52 26.68,71.12 | 26.68,71.12 26.68,63.18 24.77,61.28 v24.77,60.33 | 26.68,71.12 32.78,71.12 X5.3
VGA_R  (via drill 0.3, 0.3 pad 0.2)
  Top 0.254: C18.2 v42.55,51.75 | v41.91,71.44 40.01,73.34 40.01,76.2 38.74,77.47 27.31,77.47 R8.1 R25.1 | v41.91,68.58 39.62,68.58 X5.8
  Bottom 0.254: v42.55,51.75 42.55,54.93 41.91,55.56 v41.91,68.58 v41.91,71.44
VGA_V/SCARTSW  (via drill 0.3, 0.3 pad 0.2)
  Top 0.254: v27.95,50.8 26.36,50.8 25.41,51.75 v25.41,60.96 25.41,63.82 24.77,64.45 v24.14,64.45 | IC1.23 28.5,29.29 27.95,29.84 v27.95,30.8 | U1.23 v17.47,63.18
  Bottom 0.254: v25.41,60.96 27.31,62.87 27.31,68.9 28.26,69.85 39.06,69.85 39.6,70.39 X5.5 | v27.95,50.8 v27.95,30.8 | v17.47,63.18 17.47,63.82 18.1,64.45 20.64,64.45 20.96,64.14 23.82,64.14 v24.14,64.45
YYY
  Top 0.254: IC1.48 32.95,41.2 33.66,41.91 33.66,48.58 33.02,49.21 28.58,49.21 R29.1

### Text on the board
Bottom: bitbox | r2.5
tPlace: SDW | EXP
tNames: bitbox rev2.5